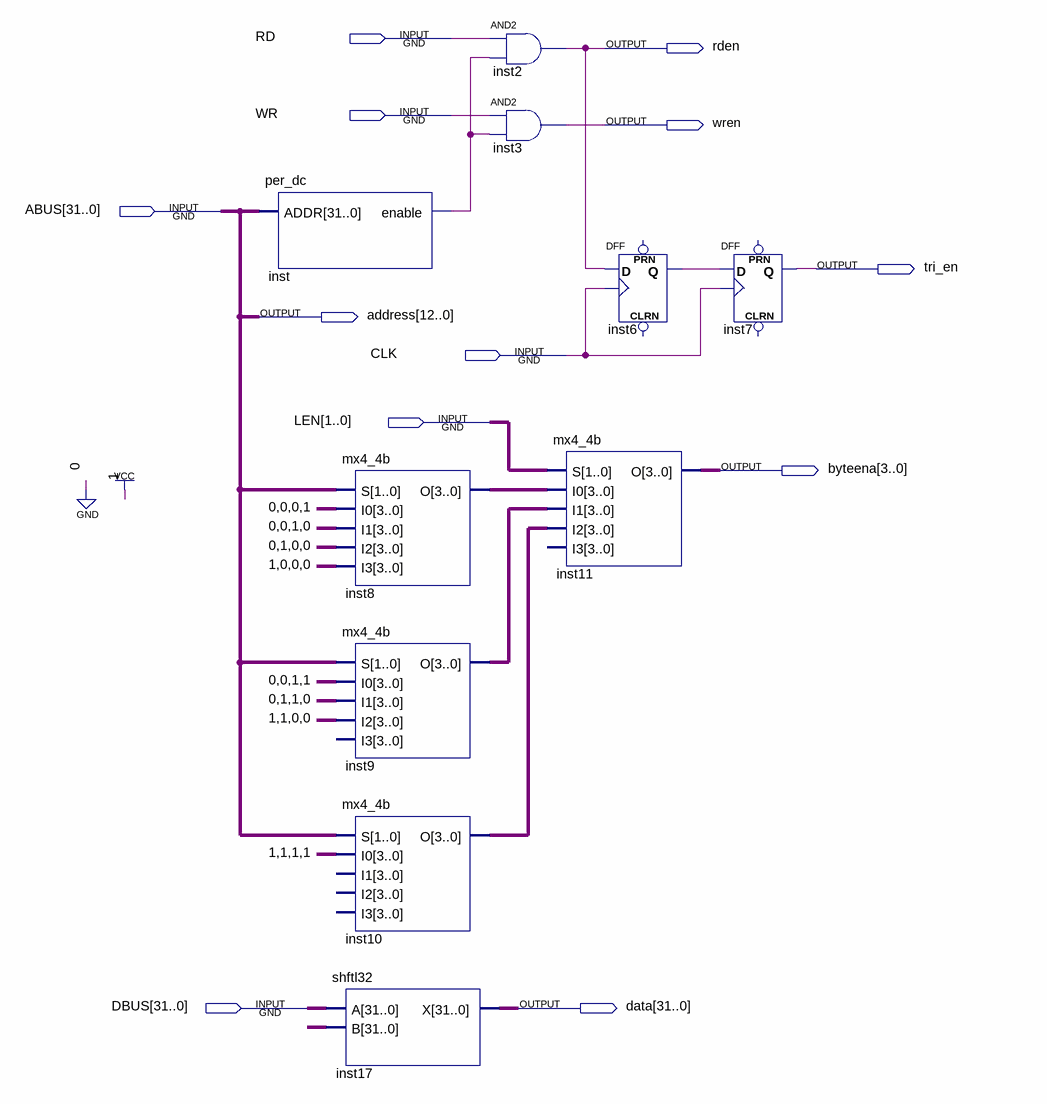
[diagram p0: schematic sheet]
// Quartus schematic sram_if.bdf as structural Verilog: 10 symbols, 12 pins
module sram_if (
  input  RD,
  input  WR,
  input  [31:0] ABUS,
  input  CLK,
  input  [1:0] LEN,
  input  [31:0] DBUS,
  output rden,
  output wren,
  output tri_en,
  output [12:0] address,
  output [3:0] byteena,
  output [31:0] data
);

  wire inst6_q, inst_enable;
  wire [3:0] inst8_o, inst9_o, inst10_o;

  per_dc inst (.ADDR(ABUS), .enable(inst_enable));
  mx4_4b inst8 (.S(ABUS[1:0]), .I0(4'b0001), .I1(4'b0010), .I2(4'b0100), .I3(4'b1000), .O(inst8_o));
  mx4_4b inst9 (.S(ABUS[1:0]), .I0(4'b0011), .I1(4'b0110), .I2(4'b1100), .O(inst9_o));  // open: I3
  mx4_4b inst10 (.S(ABUS[1:0]), .I0(4'b1111), .O(inst10_o));  // open: I1, I2, I3
  shftl32 inst17 (.A(DBUS), .B({{27{1'b0}}, ABUS[1:0], 3'b000}), .X(data));
  and inst2 (rden, RD, inst_enable);
  and inst3 (wren, WR, inst_enable);
  mx4_4b inst11 (.S(LEN), .I0(inst8_o), .I1(inst9_o), .I2(inst10_o), .O(byteena));  // open: I3
  DFF inst6 (.CLK(CLK), .D(rden), .Q(inst6_q));  // open: CLRN, PRN
  DFF inst7 (.CLK(CLK), .D(inst6_q), .Q(tri_en));  // open: CLRN, PRN

  assign address = ABUS[14:2];

  // Other names for the same wires on the sheet: addr[31:0] = ABUS
endmodule
